# Altium schematic sheet MicroPLSheet.SchDoc
size A4; SheetNumber: 2; SheetTotal: 6
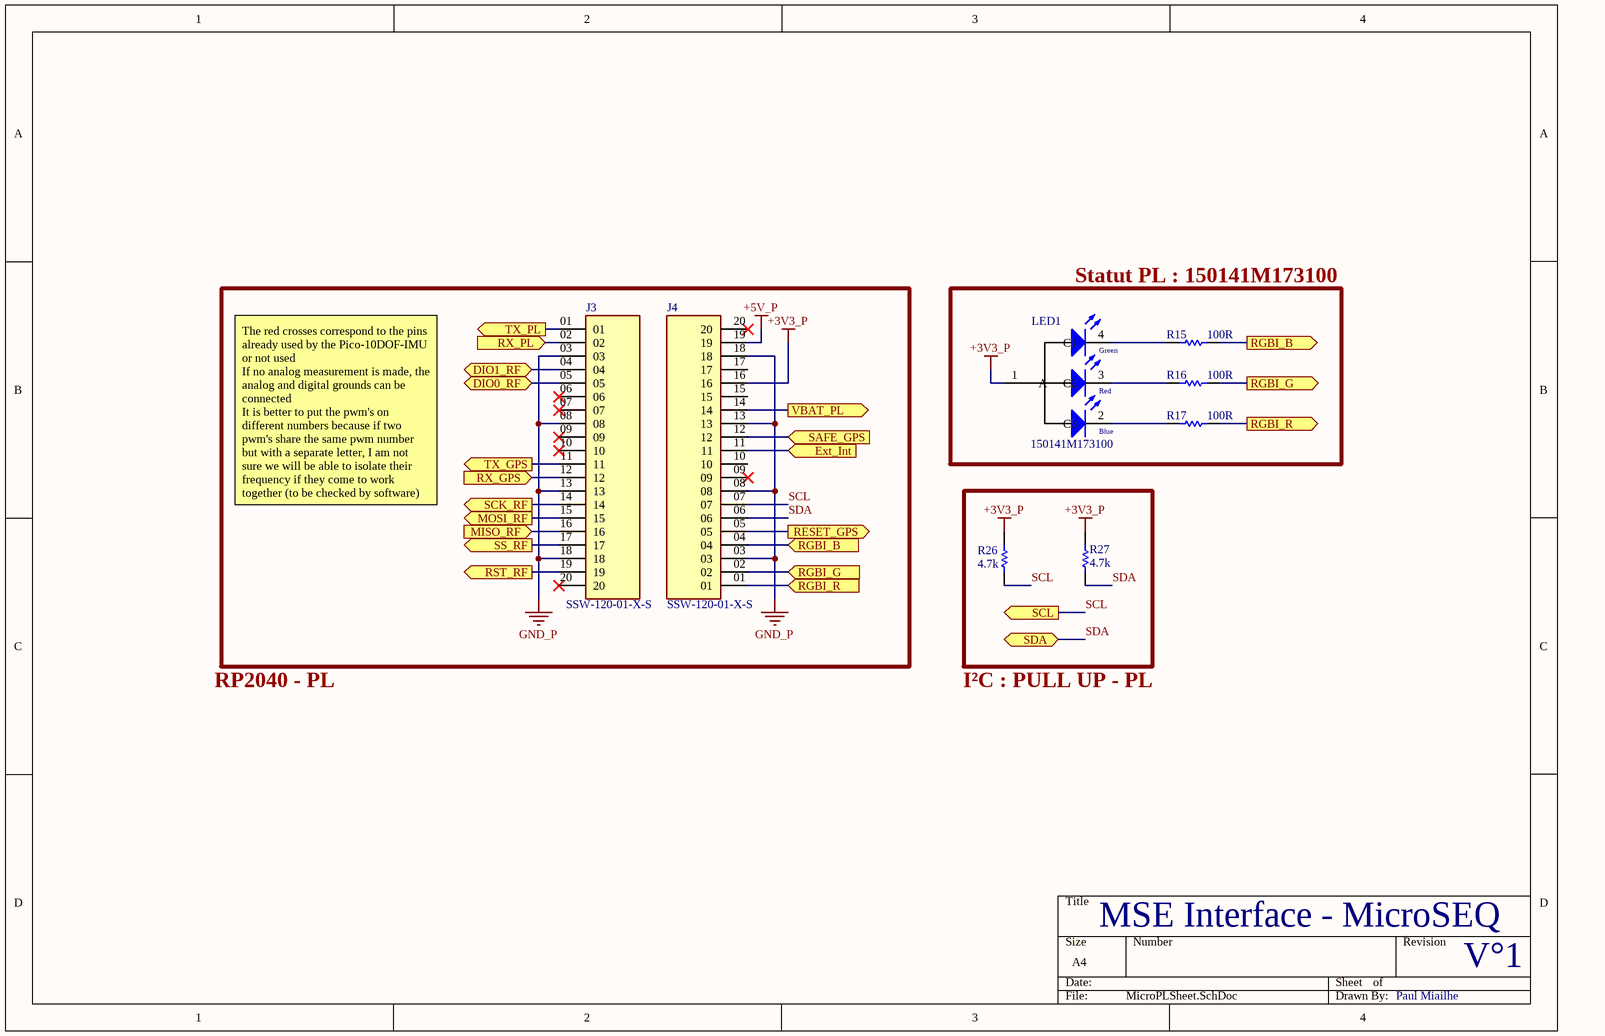
[diagram p0: MicroPLSheet.SchDoc]

## Parts
J3  SSW-120-01-X-S  [SAMTEC_SSW-120-01-X-S]
J4  SSW-120-01-X-S  [SAMTEC_SSW-120-01-X-S]
LED1  150141M173100  [3528_A]
R15  Resistance: 100R  [RESC1608X55X30LL15T15]  (hidden comment: ERJ-3EKF1000V)
R16  Resistance: 100R  [RESC1608X55X30LL15T15]  (hidden comment: ERJ-3EKF1000V)
R17  Resistance: 100R  [RESC1608X55X30LL15T15]  (hidden comment: ERJ-3EKF1000V)
R26  Resistance: 4.7k  [RESC1608X55X25LL10T15]  (hidden comment: RC0603FR-074K7L)
R27  Resistance: 4.7k  [RESC1608X55X25LL10T15]  (hidden comment: RC0603FR-074K7L)

## Blocks framed on the sheet
Statut PL : 150141M173100: LED1 R15-R17

## Ports
DIO0_RF (bidir, see MainSheet[3C]), DIO1_RF (bidir, see MainSheet[3B]), Ext_Int (in, see MainSheet[3C], GPIOSheet[1B]), MISO_RF (in, see MainSheet[3B], GPIOSheet[1B]), MOSI_RF (out, see MainSheet[3B], GPIOSheet[1B]), RESET_GPS (out, see MainSheet[3C], GPIOSheet[1B]), RGBI_B (in, see MainSheet[3C], GPIOSheet[3C]), RGBI_B (out, see MainSheet[3C], GPIOSheet[3C]), RGBI_G (in, see MainSheet[3C], GPIOSheet[4C]), RGBI_G (out, see MainSheet[3C], GPIOSheet[4C]), RGBI_R (in, see MainSheet[3C], GPIOSheet[4C]), RGBI_R (out, see MainSheet[3C], GPIOSheet[4C]), RST_RF (out, see MainSheet[3B], GPIOSheet[1B]), RX_GPS (in, see MainSheet[3C]), RX_PL (in, see MainSheet[3C], IsolationSheet[2B]), SAFE_GPS (in, see MainSheet[3C], GPIOSheet[1B]), SCK_RF (out, see MainSheet[3B], GPIOSheet[1B]), SCL (out, see MainSheet[3C]), SDA (bidir, see MainSheet[3C]), SS_RF (out, see MainSheet[3B], GPIOSheet[1B]), TX_GPS (out, see MainSheet[3C]), TX_PL (out, see MainSheet[3C], IsolationSheet[2B]), VBAT_PL (out, see MainSheet[3B], PowerSheet[2C])

## Nets
+3V3_P: J4.16 LED1.1(A) R26.2 R27.2
+5V_P: J4.19
GND_P: J3.03 J3.08 J3.13 J3.18 J4.03 J4.08 J4.13 J4.18
DIO0_RF: J3.05 ; port DIO0_RF
DIO1_RF: J3.04 ; port DIO1_RF
Ext_Int: J4.11 ; port Ext_Int
MISO_RF: J3.16 ; port MISO_RF
MOSI_RF: J3.15 ; port MOSI_RF
RESET_GPS: J4.05 ; port RESET_GPS
RGBI_B: J4.04 R15.1 ; port RGBI_B
RGBI_G: J4.02 R16.1 ; port RGBI_G
RGBI_R: J4.01 R17.1 ; port RGBI_R
RST_RF: J3.19 ; port RST_RF
RX_GPS: J3.12 ; port RX_GPS
RX_PL: J3.02 ; port RX_PL
SAFE_GPS: J4.12 ; port SAFE_GPS
SCK_RF: J3.14 ; port SCK_RF
SCL: J4.07 R26.1 ; port SCL
SDA: J4.06 R27.1 ; port SDA
SS_RF: J3.17 ; port SS_RF
TX_GPS: J3.11 ; port TX_GPS
TX_PL: J3.01 ; port TX_PL
VBAT_PL: J4.14 ; port VBAT_PL
NetLED1_2: LED1.2(C3) R17.2
NetLED1_3: LED1.3(C2) R16.2
NetLED1_4: LED1.4(C1) R15.2

Not connected (* = marked no-connect by the designer): J3 06* 07* 09* 10* 20*; J4 09* 10 15 17 20*

## Notes on the sheet
- The red crosses correspond to the pins already used by the Pico-10DOF-IMU or not used
  If no analog measurement is made, the analog and digital grounds can be connected
  It is better to put the pwm's on different numbers because if two pwm's share the same pwm number but with a separate letter, I am not sure we will be able to isolate their frequency if they come to work together (to be checked by software)
- RP2040 - PL
- I²C : PULL UP - PL
- MSE Interface - MicroSEQ
- V°1
- Paul Miailhe
- (in symbol CMP-1431-00001-1) Green; Red; Blue

## Library data of the parts
J3 J4 = CMP-011-000000-2: SSW - Samtec 2.54mm Single Row Straight Socket Strip 8.5 Profile - Fast Stock; MP: SSW-120-01-G-S; Value: *; Check_prices: https://www.snapeda.com/parts/SSW-120-01-G-S/Samtec/view-part/598388/?ref=eda; Price: None; Design Item ID: SSW-120-01-X-S; SnapEDA_Link: https://www.snapeda.com/parts/SSW-120-01-G-S/Samtec/view-part/598388/?ref=snap; Component Type: Standard; MF: Samtec; Source: SSW-120-01-X-S.SchLib; Package: None; Pin Count: 20; Availability: Bad; Purchase-URL: https://pricing.snapeda.com/search/part/SSW-120-01-G-S/?ref=eda
LED1 = CMP-1431-00001-1: SMD Full-Color Top LED, WL-SFTW, Red & Green & Blue; Manufacturer: Wuerth Elektronik; PackageReference: 3528_A; PartNumber: 150141M173100; ComponentLink2Description: Datasheet; ComponentLink1URL: http://www.we-online.com; Color: Red & Green & Blue; ComponentLink1Description: Manufacturer URL; ComponentLink2URL: http://katalog.we-online.com/led/datasheet/150141M173100.pdf
R15-R17 = CMP-2000-00179-1: Manufacturer: Panasonic; Manufacturer Part Number: ERJ3EKF1000V; Tolerance: 1%; Power Rating: 100mW; Voltage Rating: 75V; Temperature Coefficient: 100ppm/°C; Part Number: ERJ-3EKF1000V; Supplier 1: RSComponents; Supplier Part Number 1: 1755733; RoHS: Yes; Category: Chip SMD Resistors; Stock 1: 30000; Pricing 1: 5000=0,01000, 10000=0,00800, 15000=0,00800, 20000=0,00800, 5000=0,00700, 10000=0,00600, 15000=0,00600, 20000=0,00600 (USD); Mount: Surface Mount; Number of Pins: 2; Case Code (Imperial): 0603; Case Code (Metric): 1608; Weight: 7.1E-05oz; Contact Plating: Tin; Size Code: 0603; Min Operating Temperature: -55°C; Max Operating Temperature: 155°C; Packaging: Tape and Reel; Termination: SMD/SMT; Resistor Type: Thick Film; Number of Terminations: 2; Series: ERJ; Package Quantity: 5000; Max Power Dissipation: 100mW; Voltage Rating (DC): 75V; Resistance Tolerance: 1%; Construction: Rectangular; Features: Automotive AEC-Q200; Length: 1.6mm; Width: 0.8mm; Height: 0.45mm; Depth: 0.8mm; Radiation Hardening: No; REACH SVHC: No SVHC; RoHS Compliant: Yes; Military Standard: Not; Lead Free: Lead Free; ComponentLink1URL: https://datasheet.ciiva.com/34303/1987450-34303565.pdf?src-supplier=Jameco; ComponentLink1Description: https://datasheet.ciiva.com/34303/1987450-34303565.pdf?src-supplier=Jameco; ComponentLink2URL: https://datasheet.ciiva.com/7830/aoa0000ce2-7830728.pdf?src-supplier=Element14; ComponentLink2Description: https://datasheet.ciiva.com/7830/aoa0000ce2-7830728.pdf?src-supplier=Element14; ComponentLink3URL: https://datasheet.ciiva.com/46372/1678782-46372726.pdf?src-supplier=Element14; ComponentLink3Description: https://datasheet.ciiva.com/46372/1678782-46372726.pdf?src-supplier=Element14; ComponentLink4URL: https://datasheet.ciiva.com/22667/1678782-22667887.pdf?src-supplier=Element14; ComponentLink4Description: https://datasheet.ciiva.com/22667/1678782-22667887.pdf?src-supplier=Element14; ComponentLink5URL: https://datasheet.ciiva.com/46372/1678782-46372727.pdf?src-supplier=Element14; ComponentLink5Description: https://datasheet.ciiva.com/46372/1678782-46372727.pdf?src-supplier=Element14; ComponentLink6URL: https://datasheet.ciiva.com/24159/aoa0000ce2-24159753.pdf?src-supplier=Mouser; ComponentLink6Description: https://datasheet.ciiva.com/24159/aoa0000ce2-24159753.pdf?src-supplier=Mouser; ComponentLink7URL: https://datasheet.ciiva.com/16762/70260748-16762666.pdf?src-supplier=Allied+Electronics; ComponentLink7Description: https://datasheet.ciiva.com/16762/70260748-16762666.pdf?src-supplier=Allied+Electronics; ComponentLink8URL: https://datasheet.ciiva.com/16765/70260748-16765766.pdf?src-supplier=Allied+Electronics; ComponentLink8Description: https://datasheet.ciiva.com/16765/70260748-16765766.pdf?src-supplier=Allied+Electronics; ComponentLink9URL: https://datasheet.ciiva.com/9186/aoa0000ce2-9186725.pdf?src-supplier=Avnet; ComponentLink9Description: https://datasheet.ciiva.com/9186/aoa0000ce2-9186725.pdf?src-supplier=Avnet; ComponentLink10URL: https://datasheet.ciiva.com/48530/aoa0000ce2-48530986.pdf?src-supplier=Avnet; ComponentLink10Description: https://datasheet.ciiva.com/48530/aoa0000ce2-48530986.pdf?src-supplier=Avnet; ComponentLink11URL: https://datasheet.ciiva.com/30088/aoa0000ce2-30088649.pdf?src-supplier=Onlinecomponents.com; ComponentLink11Description: https://datasheet.ciiva.com/30088/aoa0000ce2-30088649.pdf?src-supplier=Onlinecomponents.com; ComponentLink12URL: https://datasheet.ciiva.com/17207/aoa0000ce2-17207983.pdf?src-supplier=Avnet+Europe; ComponentLink12Description: https://datasheet.ciiva.com/17207/aoa0000ce2-17207983.pdf?src-supplier=Avnet+Europe
R26 R27 = CMP-2000-06942-1: Chip Resistor, 4.7 KOhm, +/- 1%, 0.1 W, -55 to 155 degC, 0603 (1608 Metric), RoHS, Tape and Reel; Manufacturer: Yageo; Power Rating: 100mW; Temperature Coefficient: 100PPM/C; Voltage Rating: 50V; Package Reference: 0603; Series: RC; Datasheet Version: Rev. 7, 05/2017; Packaging: Reel; Termination Style: SMD/SMT; Datasheet URL: http://www.yageo.com/documents/recent/PYu-RC_Group_51_RoHS_L_7.pdf; Manufacturer URL: http://www.yageo.com/; Package Description: 2-Pin Surface Mount Device, Body 1.6 x 0.8 mm; Case Code - mm: 1608; Mounting Technology: SurfaceMount; Operating Temperature Range: -55Cto+155C; Tolerance: 1%; Product: ThickFilmResistorsGeneralPurpose; Supplier 1: Mouser; Supplier Part Number 1: 603-RC0603FR-074K7L; Manufacturer Part Number: RC0603FR-074K7L; RoHS: Yes; Category: Chip SMD Resistors; Stock 1: 772810; Pricing 1: 1=0,10000, 10=0,02400, 50=0,02400, 100=0,01000, 1000=0,00400, 5000=0,00300, 10000=0,00300 (USD); Case/Package: 0603; Number of Pins: 2; Case Code (Imperial): 0603; Case Code (Metric): 1608; Size Code: 0603; Min Operating Temperature: -55°C; Max Operating Temperature: 155°C; Voltage Rating (DC): 50V; Termination: SMD/SMT; Resistor Type: Thick Film; Features: Moisture Resistant; Max Power Dissipation: 100mW; Number of Terminations: 2; Construction: Rectangular; Resistance Tolerance: 1%; Length: 1.6mm; Width: 0.8mm; Height: 0.45mm; Depth: 0.8mm; Lead Pitch: 0.3mm; REACH SVHC: No SVHC; Military Standard: Not; Lead Free: Lead Free; RoHS Compliant: Yes; ComponentLink1URL: https://datasheet.ciiva.com/15189/getdatasheetpartid-422754-15189760.pdf?src-supplier=Verical; ComponentLink1Description: https://datasheet.ciiva.com/15189/getdatasheetpartid-422754-15189760.pdf?src-supplier=Verical; ComponentLink2URL: https://datasheet.ciiva.com/22747/443971-22747528.pdf?src-supplier=Element14; ComponentLink2Description: https://datasheet.ciiva.com/22747/443971-22747528.pdf?src-supplier=Element14; ComponentLink3URL: https://datasheet.ciiva.com/7660/38590-7660794.pdf?src-supplier=Element14; ComponentLink3Description: https://datasheet.ciiva.com/7660/38590-7660794.pdf?src-supplier=Element14; ComponentLink4URL: https://datasheet.ciiva.com/7746/1868787-7746365.pdf?src-supplier=Element14; ComponentLink4Description: https://datasheet.ciiva.com/7746/1868787-7746365.pdf?src-supplier=Element14; ComponentLink5URL: https://datasheet.ciiva.com/46440/1868787-46440909.pdf?src-supplier=Element14; ComponentLink5Description: https://datasheet.ciiva.com/46440/1868787-46440909.pdf?src-supplier=Element14; ComponentLink6URL: https://datasheet.ciiva.com/7746/1738695-7746366.pdf?src-supplier=Element14; ComponentLink6Description: https://datasheet.ciiva.com/7746/1738695-7746366.pdf?src-supplier=Element14